# EAGLE design CAN Traffic Teensy 4.0 rev1 (EAGLE 9.6.2)
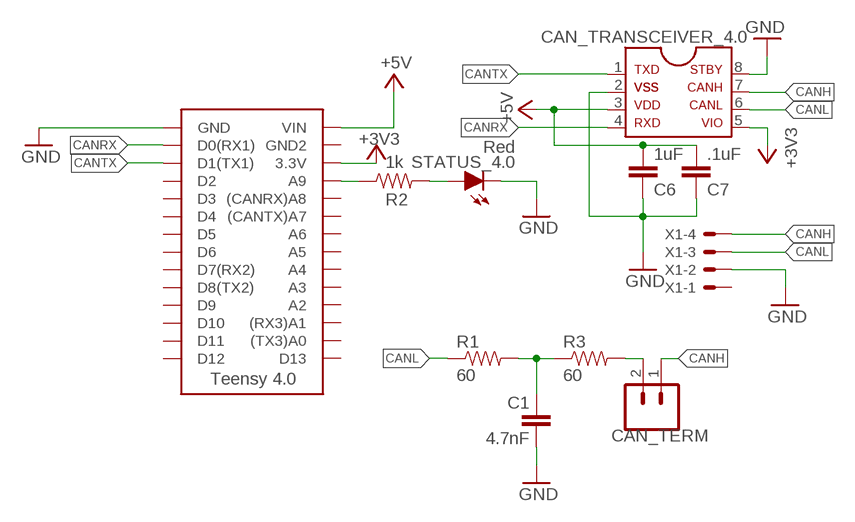
[diagram p0: schematic, sheet 1]

## Parts
4.0  TEENSY_4.0_SIMPLE  [TEENSY_4.0_SIMPLE]
C1  4.7nF  CAP0603-CAP  [0603-CAP]
C6  1uF  CAP0603-CAP  [0603-CAP]
C7  .1uF  CAP0603-CAP  [0603-CAP]
CAN_TERM  M02_SLIM  [1X02_SLIM]
CAN_TRANSCEIVER_4.0  MCP2562FDSOIC-08  [SOIC-08]
R1  60  RESISTOR0603-RES  [0603-RES]
R2  1k  RESISTOR0603-RES  [0603-RES]
R3  60  RESISTOR0603-RES  [0603-RES]
STATUS_4.0  Red  LED-0603  [LED-603]
X1  CONNECTOR-4NANO-FIT_RIGHT_ANGLE-4-SURFACE  [NANO-FIT_RIGHT_ANGLE-4-SURFACE]

## Nets
+3V3: 4.0.3.3V CAN_TRANSCEIVER_4.0.5
+5V: 4.0.VIN C6.1 C7.1 CAN_TRANSCEIVER_4.0.3
CANH: CAN_TERM.1 CAN_TRANSCEIVER_4.0.7 X1.4
CANL: CAN_TRANSCEIVER_4.0.6 R1.1 X1.3
CANRX: 4.0.D0(RX1) CAN_TRANSCEIVER_4.0.4
CANTX: 4.0.D1(TX1) CAN_TRANSCEIVER_4.0.1
GND: 4.0.GND C1.2 C6.2 C7.2 CAN_TRANSCEIVER_4.0.2 CAN_TRANSCEIVER_4.0.8 STATUS_4.0.C X1.2
N$1: 4.0.A9 R2.1
N$2: R2.2 STATUS_4.0.A
N$4: C1.1 R1.2 R3.1
N$5: CAN_TERM.2 R3.2
Unconnected: 4.0.(CANRX)A8 4.0.(CANTX)A7 4.0.(RX3)A1 4.0.(TX3)A0 4.0.A2 4.0.A3 4.0.A4 4.0.A5 4.0.A6 4.0.D2 4.0.D3 4.0.D4 4.0.D5 4.0.D6 4.0.D7(RX2) 4.0.D8(TX2) 4.0.D9 4.0.D10 4.0.D11 4.0.D12 4.0.D13 4.0.GND2 X1.1

## Library data of the parts
4.0 = HyTechDevices:TEENSY_4.0_SIMPLE: Simple version of the Teensy 4.0 board that only uses the 2 main rows of pins, with no perpendicular row with VBat.
C1 C6 C7 = HyTechDevices:CAP: Capacitor Standard 0603 ceramic capacitor, and 0.1" leaded capacitor.
CAN_TERM = HyTechDevices:M02: Standard 2-pin 0.1" header. NOTES ON THE VARIANTS LOCK and LOCK_LONGPADS... This footprint was designed to help hold the alignment of a through-hole component (i.e. 6-pin header) while soldering it into place. You may notice that each hole has been shifted either up or down by 0.005 of an inch from it's more standard position (which is a perfectly straight line). This slight alteration caused the pins (the squares in the middle) to touch the edges of the holes. Because they are alternating, it causes a "brace" to hold the component in place. 0.005 has proven to be the perfect amount of "off-center" position when using our standard breakaway headers. Although looks a little odd when you look at the bare footprint, once you have a header in there, the alteration is very hard to notice. Also,if you push a header all the way into place, it is covered up entirely on the bottom side. This idea of altering the position of holes to aid alignment will be further integrated into the Sparkfun Library for other footprints. It can help hold any component with 3 or more connection pins. Note: The Sparkfun version includes many other packages including surface mount that may be of future interest. Source: Sparkfun <https://github.com/sparkfun/SparkFun-Eagle-Libraries>
CAN_TRANSCEIVER_4.0 = HyTechDevices:MCP2562FD: MCP2562FD High-speed CAN Transceiver Datatsheet <http://ww1.microchip.com/downloads/en/devicedoc/20005167c.pdf>
R1-R3 = HyTechDevices:RESISTOR: Resistor Basic schematic elements and footprints for 0603, 1206, and PTH resistors.
STATUS_4.0 = HyTechDevices:LED: Light Emitting Diode (LED) Source: Dangerous Prototypes Eagle Library <https://github.com/DangerousPrototypes/Eagle_Part_Library>
X1 = HyTechDevices:CONNECTOR-4: Mini-Fit Junior connector 4 pole Source: http://www.molex.com

## Board
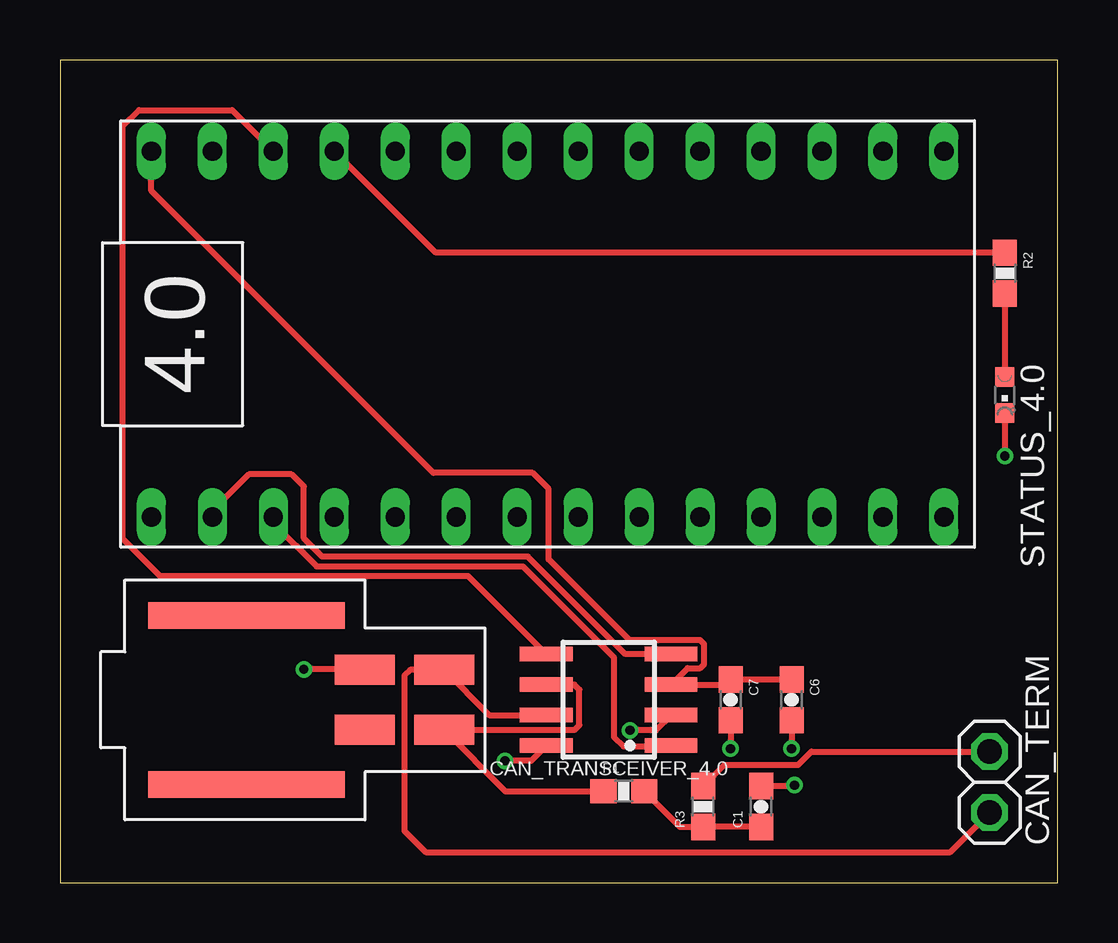
[diagram p1: board, top side]
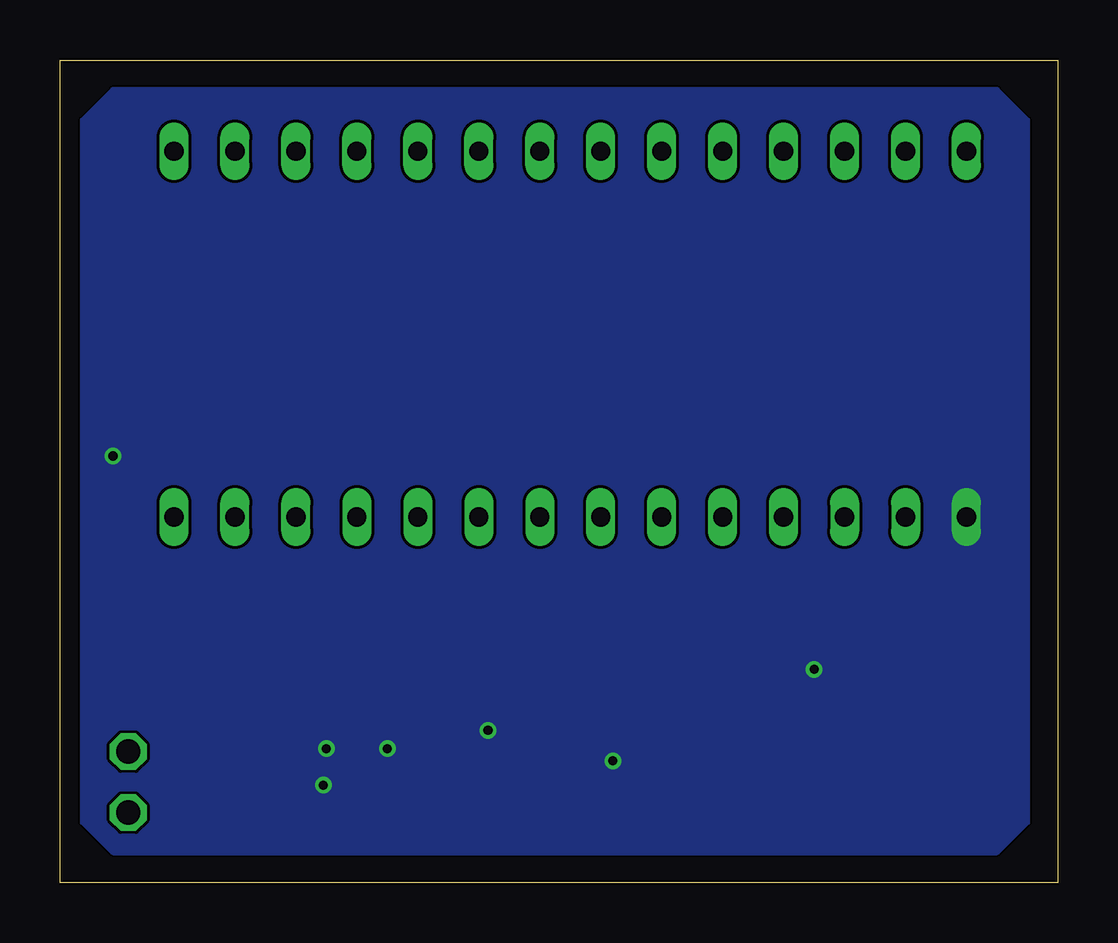
[diagram p2: board, bottom side, seen from below]

Size 41.58 x 34.28 mm. Coordinates in mm from the lower left corner, seen from the top.
Outline: 0,0 41.58,0 41.58,34.28 0,34.28 0,0
Copper layers (1*16): Top 0.035mm / dielectric 1.53mm / Bottom 0.035mm
Design rules "JLCPCB (2 Layer)": minimum track width 5mil, minimum drill 0.3mm, track to track 5mil, track to pad 5mil, pad to pad 5mil, via to via 20mil, smd to smd 5mil, copper to edge 0.2mm, drill to drill 21mil, minimum pad ring 6mil, minimum via ring 6mil, stop-mask expansion 6mil, vias tented up to drill 30mil, thermal gap 10mil

### Footprints (pad centres in the part's own frame; a part is rotated, then mirrored left to right if it is on the bottom)
TEENSY_4.0_SIMPLE = drill 0.8 long: 3.3V 16.51,29.21; (CANRX)A8 16.51,24.13; (CANTX)A7 16.51,21.59; (RX3)A1 16.51,6.35; (TX3)A0 16.51,3.81; A2 16.51,8.89; A3 16.51,11.43; A4 16.51,13.97; A5 16.51,16.51; A6 16.51,19.05; A9 16.51,26.67; D0(RX1) 1.27,31.75; D1(TX1) 1.27,29.21; D2 1.27,26.67; D3 1.27,24.13; D4 1.27,21.59; D5 1.27,19.05; D6 1.27,16.51; D7(RX2) 1.27,13.97; D8(TX2) 1.27,11.43; D9 1.27,8.89; D10 1.27,6.35; D11 1.27,3.81; D12 1.27,1.27; D13 16.51,1.27; GND 1.27,34.29; GND2 16.51,31.75; VIN 16.51,34.29
0603-CAP = smd 1.1 x 1: 1 -0.85,0; 2 0.85,0
1X02_SLIM = drill 1.016 octagon: 1 -1.27,0; 2 1.27,0
SOIC-08 = smd 0.6 x 2.2: 1 -1.905,-2.6; 2 -0.635,-2.6; 3 0.635,-2.6; 4 1.905,-2.6; 5 1.905,2.6; 6 0.635,2.6; 7 -0.635,2.6; 8 -1.905,2.6
0603-RES = smd 1.1 x 1: 1 -0.85,0; 2 0.85,0
LED-603 = smd 0.8 x 0.8: A 0,-0.75; C 0,0.75
NANO-FIT_RIGHT_ANGLE-4-SURFACE = smd 1.24 x 2.5: 1 1.25,0; 2 -1.25,0; 3 1.25,3.3; 4 -1.25,3.3 | smd 1.1 x 8.2: P$5 -3.52,-4.93; P$6 3.52,-4.93

### Placement (x,y rotation side)
4.0  38.1,13.97 90 top
C1  29.21,3.17 90 top
C6  30.48,7.62 270 top
C7  27.94,7.62 270 top
CAN_TERM  38.73,4.19 90 top
CAN_TRANSCEIVER_4.0  22.86,7.62 90 top
R1  23.5,3.81 0 top
R2  39.37,25.4 270 top
R3  26.8,3.17 90 top
STATUS_4.0  39.37,20.32 180 top
X1  12.7,7.62 270 top

### Tracks (layer width: path | path; a pad name or v marks a point on that pad's centre or on a via)
+3V3
  Top 0.254: CAN_TRANSCEIVER_4.0.5 17.01,12.78 4.17,12.78 2.62,14.33 2.62,31.52 3.3,32.19 7.18,32.19 4.0.3.3V
+5V
  Top 0.254: C6.1 C7.1 27.73,8.26 CAN_TRANSCEIVER_4.0.3 26.15,8.95 26.68,8.95 26.84,9.11 26.84,9.94 26.68,10.1 23.74,10.1 20.36,13.48 20.36,16.41 19.69,17.08 15.56,17.08 3.81,28.83 4.0.VIN
CANH
  Top 0.254: CAN_TRANSCEIVER_4.0.7 17.89,6.99 X1.4 14.59,8.87 14.35,8.64 14.35,2.16 15.24,1.27 37.08,1.27 CAN_TERM.1
CANL
  Top 0.254: CAN_TRANSCEIVER_4.0.6 21.43,8.26 21.64,8.05 21.64,6.57 21.44,6.37 X1.3 18.56,3.81 R1.1
CANRX
  Top 0.254: CAN_TRANSCEIVER_4.0.4 23.55,9.53 19.49,13.59 10.92,13.59 10.16,14.35 10.16,16.51 9.65,17.02 7.87,17.02 6.35,15.49 4.0.D0(RX1)
CANTX
  Top 0.254: 4.0.D1(TX1) 8.89,14.99 10.69,13.18 19.28,13.18 23.08,9.39 23.08,6.07 23.47,5.68 25.42,5.68 CAN_TRANSCEIVER_4.0.1
GND  (via drill 0.38)
  Top 0.254: CAN_TRANSCEIVER_4.0.8 19.62,5.08 v18.54,5.08 | X1.2 12.68,8.89 v10.16,8.89 | CAN_TRANSCEIVER_4.0.2 24.82,6.35 v23.75,6.35 | C7.2 v27.94,5.59 | C6.2 v30.48,5.59 | STATUS_4.0.C v39.37,17.78 | v30.61,4.06 30.57,4.03 C1.2
  pour Bottom (no thermals): 2.54,1.27 1.27,2.54 1.27,31.75 2.54,33.02 39.37,33.02 40.64,31.75 40.64,2.54 39.37,1.27
N$1
  Top 0.254: R2.1 15.66,26.25 4.0.A9
N$2
  Top 0.254: R2.2 STATUS_4.0.A
N$4
  Top 0.254: R1.2 25.83,2.33 R3.1 C1.1
N$5
  Top 0.254: R3.2 27.69,4.92 30.76,4.92 31.3,5.46 CAN_TERM.2

### Text on the board
tDocu: TEENSY 4.0